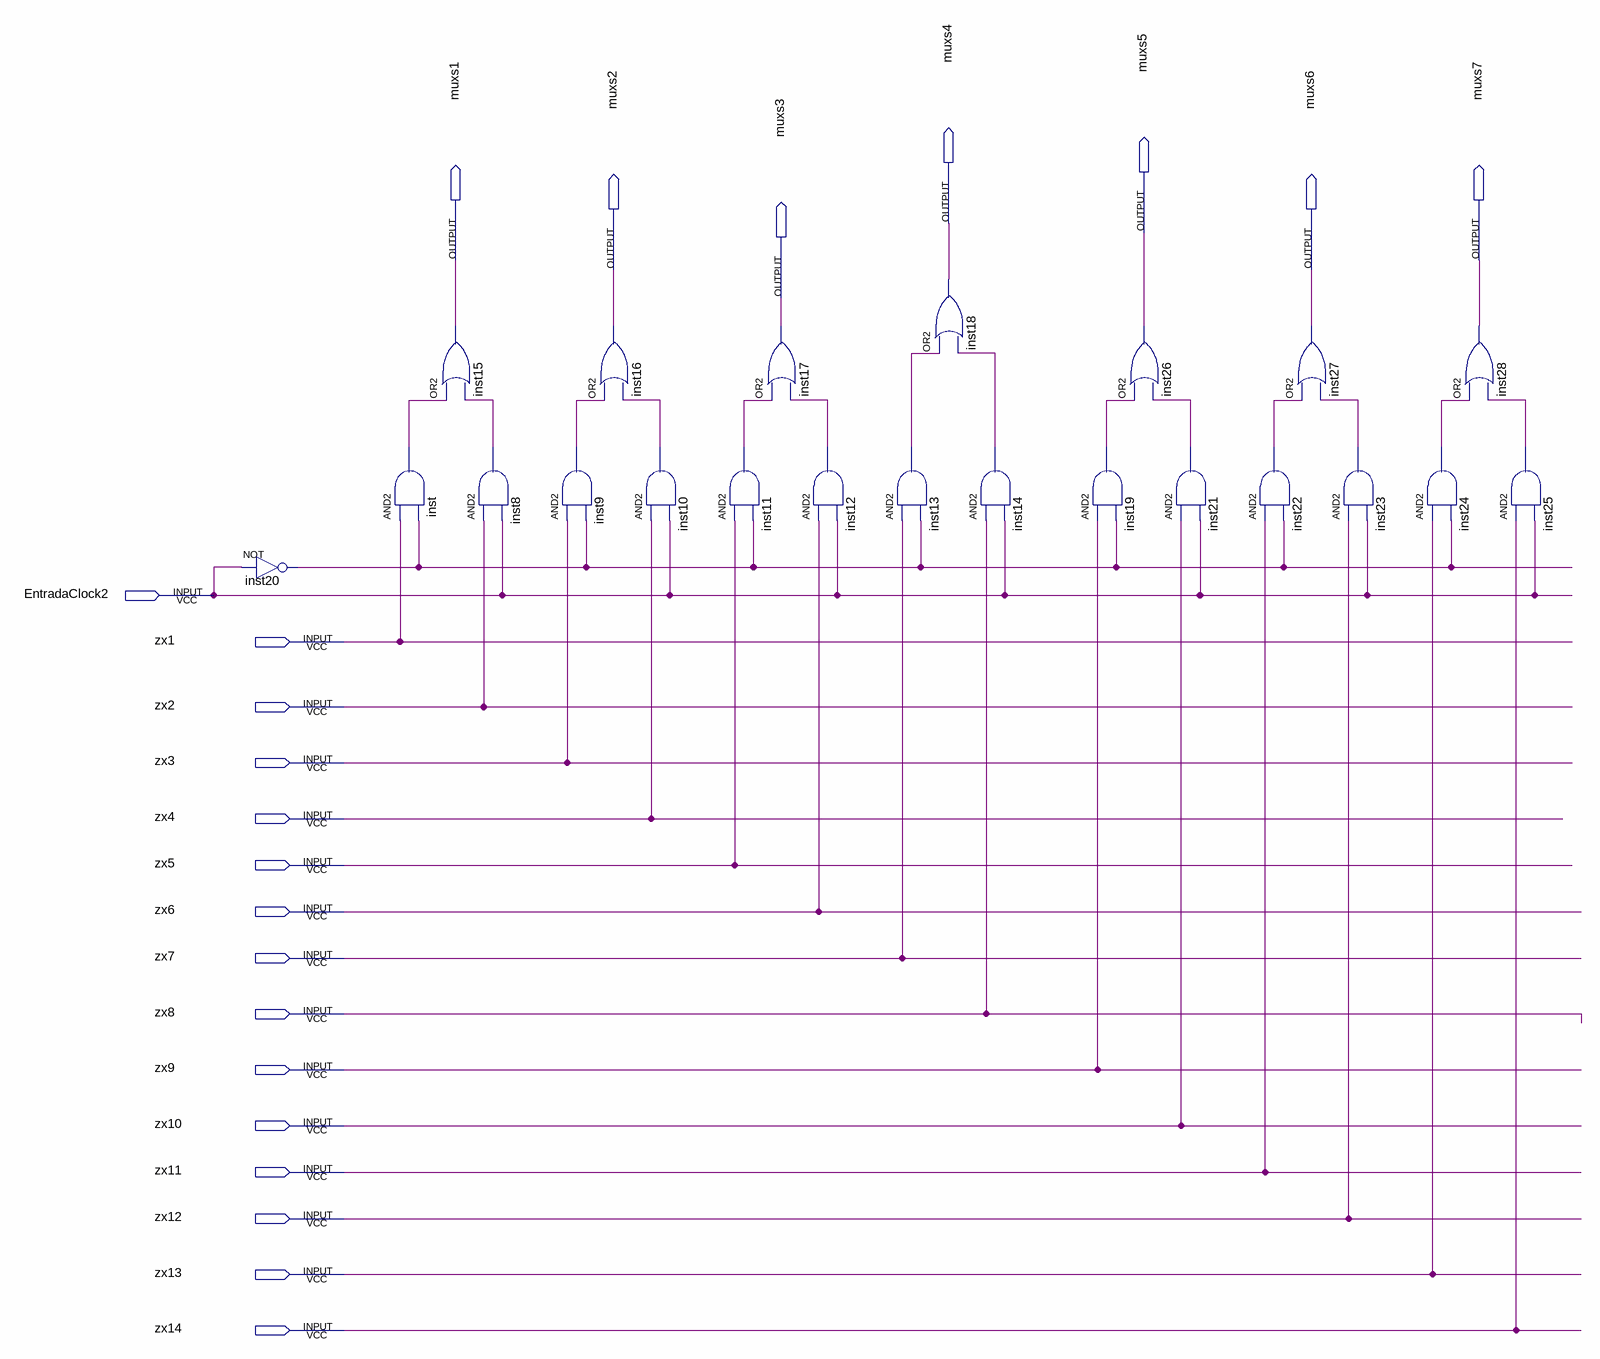
[diagram p0: schematic sheet]
// Quartus schematic mux14x7.bdf as structural Verilog: 22 symbols, 22 pins
module mux14x7 (
  input  EntradaClock2,
  input  zx1,
  input  zx2,
  input  zx3,
  input  zx4,
  input  zx5,
  input  zx6,
  input  zx7,
  input  zx8,
  input  zx9,
  input  zx10,
  input  zx11,
  input  zx12,
  input  zx13,
  input  zx14,
  output muxs4,
  output muxs5,
  output muxs1,
  output muxs7,
  output muxs2,
  output muxs6,
  output muxs3
);

  wire inst8_out, inst9_out, inst10_out, inst11_out, inst12_out, inst13_out, inst14_out, inst19_out,
       inst20_out, inst21_out, inst22_out, inst23_out, inst24_out, inst25_out, inst_out;

  not inst20 (inst20_out, EntradaClock2);
  and inst (inst_out, zx1, inst20_out);
  or inst15 (muxs1, inst_out, inst8_out);
  and inst8 (inst8_out, zx2, EntradaClock2);
  and inst9 (inst9_out, zx3, inst20_out);
  or inst16 (muxs2, inst9_out, inst10_out);
  and inst10 (inst10_out, zx4, EntradaClock2);
  or inst17 (muxs3, inst11_out, inst12_out);
  and inst11 (inst11_out, zx5, inst20_out);
  and inst12 (inst12_out, zx6, EntradaClock2);
  or inst18 (muxs4, inst13_out, inst14_out);
  and inst13 (inst13_out, zx7, inst20_out);
  and inst14 (inst14_out, zx8, EntradaClock2);
  or inst26 (muxs5, inst19_out, inst21_out);
  and inst19 (inst19_out, zx9, inst20_out);
  and inst21 (inst21_out, zx10, EntradaClock2);
  or inst27 (muxs6, inst22_out, inst23_out);
  and inst22 (inst22_out, zx11, inst20_out);
  and inst23 (inst23_out, zx12, EntradaClock2);
  and inst24 (inst24_out, zx13, inst20_out);
  or inst28 (muxs7, inst24_out, inst25_out);
  and inst25 (inst25_out, zx14, EntradaClock2);
endmodule
